# EAGLE design matrix-2col (EAGLE 9.3.1)
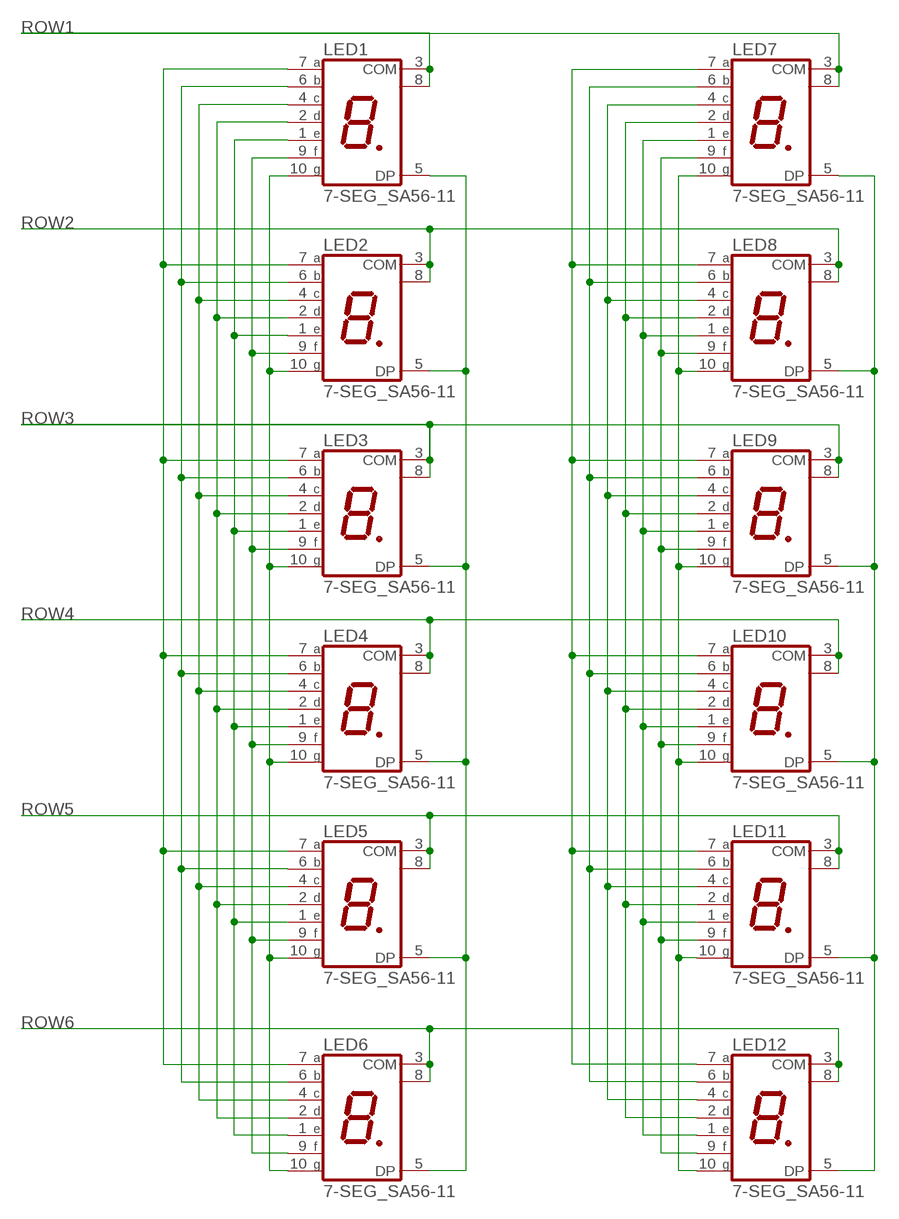
[diagram p0: schematic, sheet 1]

## Parts
LED1  7-SEG_SA56-11  [SA56-11]
LED2  7-SEG_SA56-11  [SA56-11]
LED3  7-SEG_SA56-11  [SA56-11]
LED4  7-SEG_SA56-11  [SA56-11]
LED5  7-SEG_SA56-11  [SA56-11]
LED6  7-SEG_SA56-11  [SA56-11]
LED7  7-SEG_SA56-11  [SA56-11]
LED8  7-SEG_SA56-11  [SA56-11]
LED9  7-SEG_SA56-11  [SA56-11]
LED10  7-SEG_SA56-11  [SA56-11]
LED11  7-SEG_SA56-11  [SA56-11]
LED12  7-SEG_SA56-11  [SA56-11]

## Nets
N$1: LED1.10(G) LED2.10(G) LED3.10(G) LED4.10(G) LED5.10(G) LED6.10(G)
N$2: LED1.5(DP) LED2.5(DP) LED3.5(DP) LED4.5(DP) LED5.5(DP) LED6.5(DP)
N$3: LED7.10(G) LED8.10(G) LED9.10(G) LED10.10(G) LED11.10(G) LED12.10(G)
N$4: LED7.9(F) LED8.9(F) LED9.9(F) LED10.9(F) LED11.9(F) LED12.9(F)
N$5: LED7.1(E) LED8.1(E) LED9.1(E) LED10.1(E) LED11.1(E) LED12.1(E)
N$6: LED1.7(A) LED2.7(A) LED3.7(A) LED4.7(A) LED5.7(A) LED6.7(A)
N$7: LED1.6(B) LED2.6(B) LED3.6(B) LED4.6(B) LED5.6(B) LED6.6(B)
N$8: LED1.9(F) LED2.9(F) LED3.9(F) LED4.9(F) LED5.9(F) LED6.9(F)
N$9: LED1.1(E) LED2.1(E) LED3.1(E) LED4.1(E) LED5.1(E) LED6.1(E)
N$10: LED1.2(D) LED2.2(D) LED3.2(D) LED4.2(D) LED5.2(D) LED6.2(D)
N$11: LED1.4(C) LED2.4(C) LED3.4(C) LED4.4(C) LED5.4(C) LED6.4(C)
N$12: LED7.2(D) LED8.2(D) LED9.2(D) LED10.2(D) LED11.2(D) LED12.2(D)
N$13: LED7.4(C) LED8.4(C) LED9.4(C) LED10.4(C) LED11.4(C) LED12.4(C)
N$14: LED7.6(B) LED8.6(B) LED9.6(B) LED10.6(B) LED11.6(B) LED12.6(B)
N$15: LED7.7(A) LED8.7(A) LED9.7(A) LED10.7(A) LED11.7(A) LED12.7(A)
N$16: LED7.5(DP) LED8.5(DP) LED9.5(DP) LED10.5(DP) LED11.5(DP) LED12.5(DP)
ROW1: LED1.3(COM) LED1.8(COM) LED7.3(COM) LED7.8(COM)
ROW2: LED2.3(COM) LED2.8(COM) LED8.3(COM) LED8.8(COM)
ROW3: LED3.3(COM) LED3.8(COM) LED9.3(COM) LED9.8(COM)
ROW4: LED4.3(COM) LED4.8(COM) LED10.3(COM) LED10.8(COM)
ROW5: LED5.3(COM) LED5.8(COM) LED11.3(COM) LED11.8(COM)
ROW6: LED6.3(COM) LED6.8(COM) LED12.3(COM) LED12.8(COM)

## Library data of the parts
LED1-LED12 = display-kingbright:7-SEG_: Kingbright 14.2mm (0.56 INCH) SINGLE DIGIT NUMERIC DUISPLAY Source: SA56-11EWA(Ver1189471036.pdf; OC_FARNELL: unknown; OC_NEWARK: unknown

## Board
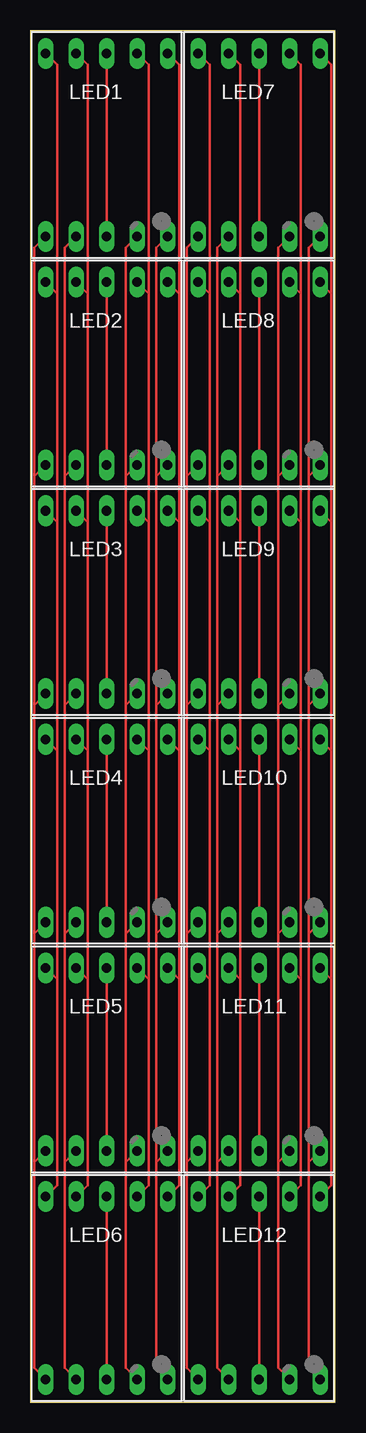
[diagram p1: board, top side]
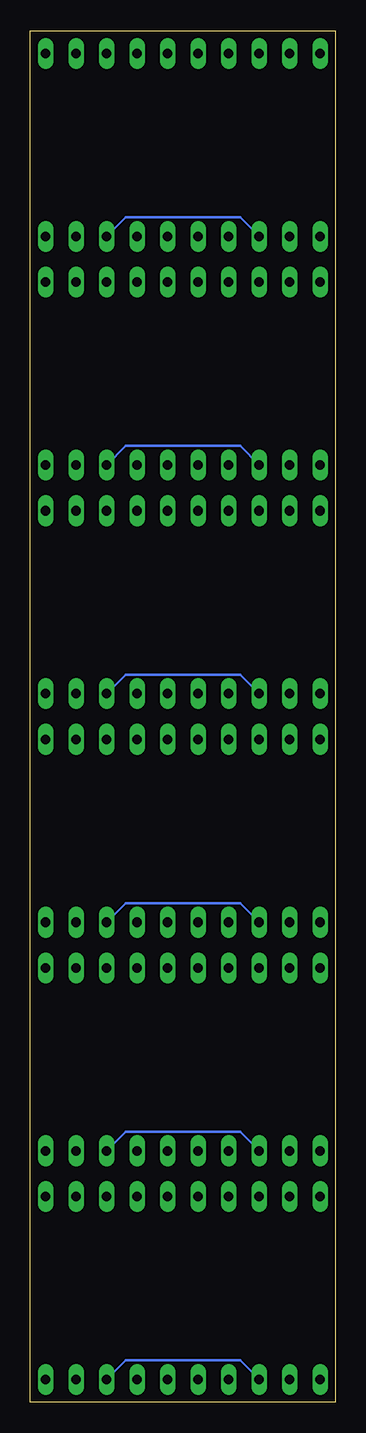
[diagram p2: board, bottom side, seen from below]

Size 25.4 x 114.3 mm. Coordinates in mm from the lower left corner, seen from the top.
Outline: 0,0 25.4,0 25.4,114.3 0,114.3 0,0
Copper layers (1*16): Top 0.035mm / dielectric 1.5mm / Bottom 0.035mm
Design rules "default *": minimum track width 8mil, minimum drill 0.35mm, track to track 6mil, track to pad 6mil, pad to pad 6mil, via to via 6mil, smd to smd 6mil, copper to edge 0mil, drill to drill 6mil, minimum pad ring 10mil, minimum via ring 8mil, stop-mask expansion 4mil, vias tented up to drill 0mil, thermal gap 10mil

### Footprints (pad centres in the part's own frame; a part is rotated, then mirrored left to right if it is on the bottom)
SA56-11 = drill 0.8 long: 1 -5.08,-7.62; 2 -2.54,-7.62; 3 0,-7.62; 4 2.54,-7.62; 5 5.08,-7.62; 6 5.08,7.62; 7 2.54,7.62; 8 0,7.62; 9 -2.54,7.62; 10 -5.08,7.62

### Placement (x,y rotation side)
LED1  6.35,104.78 0 top
LED2  6.35,85.72 0 top
LED3  6.35,66.67 0 top
LED4  6.35,47.62 0 top
LED5  6.35,28.57 0 top
LED6  6.35,9.53 0 top
LED7  19.05,104.78 0 top
LED8  19.05,85.72 0 top
LED9  19.05,66.67 0 top
LED10  19.05,47.62 0 top
LED11  19.05,28.57 0 top
LED12  19.05,9.53 0 top

### Tracks (layer width: path | path; a pad name or v marks a point on that pad's centre or on a via)
N$1
  Top 0.203: LED6.10 2.22,18.1 2.22,35.24 | LED5.10 2.22,35.24 | 2.22,54.29 LED4.10 | 2.22,35.24 2.22,54.29 | 2.22,73.34 LED3.10 | 2.22,54.29 2.22,73.34 | 2.22,92.39 LED2.10 | 2.22,73.34 2.22,92.39 | LED1.10 2.22,111.44 2.22,92.39
N$2
  Top 0.203: LED6.5 10.48,2.86 10.48,20 | LED5.5 10.48,20 | 10.48,39.05 LED4.5 | 10.48,20 10.48,39.05 | 10.48,58.1 LED3.5 | 10.48,39.05 10.48,58.1 | 10.48,77.15 LED2.5 | 10.48,58.1 10.48,77.15 | LED1.5 10.48,96.2 10.48,77.15
N$3
  Top 0.203: LED12.10 14.92,18.1 14.92,35.24 | LED11.10 14.92,35.24 | 14.92,54.29 LED10.10 | 14.92,35.24 14.92,54.29 | 14.92,73.34 LED9.10 | 14.92,54.29 14.92,73.34 | 14.92,92.39 LED8.10 | 14.92,73.34 14.92,92.39 | LED7.10 14.92,111.44 14.92,92.39
N$4
  Top 0.203: LED12.9 17.46,18.1 17.46,35.24 | LED11.9 17.46,35.24 | 17.46,54.29 LED10.9 | 17.46,35.24 17.46,54.29 | 17.46,73.34 LED9.9 | 17.46,54.29 17.46,73.34 | 17.46,92.39 LED8.9 | 17.46,73.34 17.46,92.39 | LED7.9 17.46,111.44 17.46,92.39
N$5
  Top 0.203: LED12.1 13.02,2.86 13.02,20 | LED11.1 13.02,20 | 13.02,39.05 LED10.1 | 13.02,20 13.02,39.05 | 13.02,58.1 LED9.1 | 13.02,39.05 13.02,58.1 | 13.02,77.15 LED8.1 | 13.02,58.1 13.02,77.15 | LED7.1 13.02,96.2 13.02,77.15
N$6
  Top 0.203: LED6.7 9.84,18.1 9.84,35.24 | LED5.7 9.84,35.24 | 9.84,54.29 LED4.7 | 9.84,35.24 9.84,54.29 | 9.84,73.34 LED3.7 | 9.84,54.29 9.84,73.34 | 9.84,92.39 LED2.7 | 9.84,73.34 9.84,92.39 | LED1.7 9.84,111.44 9.84,92.39
N$7
  Top 0.203: LED6.6 12.38,18.1 12.38,35.24 | LED5.6 12.38,35.24 | 12.38,54.29 LED4.6 | 12.38,35.24 12.38,54.29 | 12.38,73.34 LED3.6 | 12.38,54.29 12.38,73.34 | 12.38,92.39 LED2.6 | 12.38,73.34 12.38,92.39 | LED1.6 12.38,111.44 12.38,92.39
N$8
  Top 0.203: LED6.9 4.76,18.1 4.76,35.24 | LED5.9 4.76,35.24 | 4.76,54.29 LED4.9 | 4.76,35.24 4.76,54.29 | 4.76,73.34 LED3.9 | 4.76,54.29 4.76,73.34 | 4.76,92.39 LED2.9 | 4.76,73.34 4.76,92.39 | LED1.9 4.76,111.44 4.76,92.39
N$9
  Top 0.203: LED6.1 0.32,2.86 0.32,20 | LED5.1 0.32,20 | 0.32,39.05 LED4.1 | 0.32,20 0.32,39.05 | 0.32,58.1 LED3.1 | 0.32,39.05 0.32,58.1 | 0.32,77.15 LED2.1 | 0.32,58.1 0.32,77.15 | LED1.1 0.32,96.2 0.32,77.15
N$10
  Top 0.203: LED6.2 2.86,2.86 2.86,20 | LED5.2 2.86,20 | 2.86,39.05 LED4.2 | 2.86,20 2.86,39.05 | 2.86,58.1 LED3.2 | 2.86,39.05 2.86,58.1 | 2.86,77.15 LED2.2 | 2.86,58.1 2.86,77.15 | LED1.2 2.86,96.2 2.86,77.15
N$11
  Top 0.203: LED6.4 7.94,2.86 7.94,20 | LED5.4 7.94,20 | 7.94,39.05 LED4.4 | 7.94,20 7.94,39.05 | 7.94,58.1 LED3.4 | 7.94,39.05 7.94,58.1 | 7.94,77.15 LED2.4 | 7.94,58.1 7.94,77.15 | LED1.4 7.94,96.2 7.94,77.15
N$12
  Top 0.203: LED12.2 15.56,2.86 15.56,20 | LED11.2 15.56,20 | 15.56,39.05 LED10.2 | 15.56,20 15.56,39.05 | 15.56,58.1 LED9.2 | 15.56,39.05 15.56,58.1 | 15.56,77.15 LED8.2 | 15.56,58.1 15.56,77.15 | LED7.2 15.56,96.2 15.56,77.15
N$13
  Top 0.203: LED12.4 20.64,2.86 20.64,20 | LED11.4 20.64,20 | 20.64,39.05 LED10.4 | 20.64,20 20.64,39.05 | 20.64,58.1 LED9.4 | 20.64,39.05 20.64,58.1 | 20.64,77.15 LED8.4 | 20.64,58.1 20.64,77.15 | LED7.4 20.64,96.2 20.64,77.15
N$14
  Top 0.203: LED12.6 25.08,18.1 25.08,35.24 | LED11.6 25.08,35.24 | 25.08,54.29 LED10.6 | 25.08,35.24 25.08,54.29 | 25.08,73.34 LED9.6 | 25.08,54.29 25.08,73.34 | 25.08,92.39 LED8.6 | 25.08,73.34 25.08,92.39 | LED7.6 25.08,111.44 25.08,92.39
N$15
  Top 0.203: LED12.7 22.54,18.1 22.54,35.24 | LED11.7 22.54,35.24 | 22.54,54.29 LED10.7 | 22.54,35.24 22.54,54.29 | 22.54,73.34 LED9.7 | 22.54,54.29 22.54,73.34 | 22.54,92.39 LED8.7 | 22.54,73.34 22.54,92.39 | LED7.7 22.54,111.44 22.54,92.39
N$16
  Top 0.203: LED12.5 23.18,2.86 23.18,20 | LED11.5 23.18,20 | 23.18,39.05 LED10.5 | 23.18,20 23.18,39.05 | 23.18,58.1 LED9.5 | 23.18,39.05 23.18,58.1 | 23.18,77.15 LED8.5 | 23.18,58.1 23.18,77.15 | LED7.5 23.18,96.2 23.18,77.15
ROW1
  Top 0.203: LED1.8 LED1.3 | LED7.8 LED7.3
  Bottom 0.203: LED1.3 7.94,98.74 17.46,98.74 LED7.3
ROW2
  Top 0.203: LED2.8 LED2.3 | LED8.8 LED8.3
  Bottom 0.203: LED2.3 7.94,79.69 17.46,79.69 LED8.3
ROW3
  Top 0.203: LED3.8 LED3.3 | LED9.8 LED9.3
  Bottom 0.203: LED3.3 7.94,60.64 17.46,60.64 LED9.3
ROW4
  Top 0.203: LED4.8 LED4.3 | LED10.8 LED10.3
  Bottom 0.203: LED4.3 7.94,41.59 17.46,41.59 LED10.3
ROW5
  Top 0.203: LED5.8 LED5.3 | LED11.8 LED11.3
  Bottom 0.203: LED5.3 7.94,22.54 17.46,22.54 LED11.3
ROW6
  Top 0.203: LED6.8 LED6.3 | LED12.8 LED12.3
  Bottom 0.203: LED6.3 7.94,3.49 17.46,3.49 LED12.3